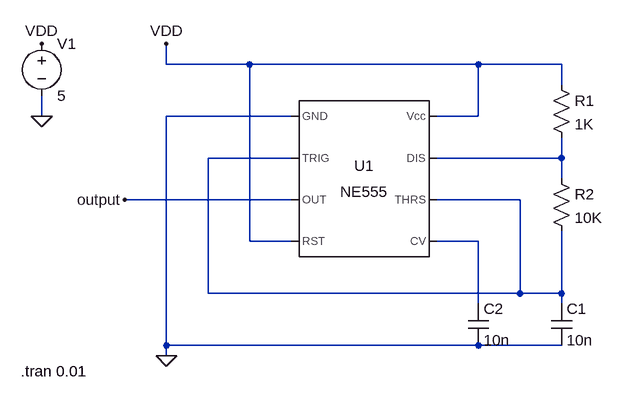
[diagram p0: schematic Design2_10k.asc]
Design2_10k.asc, the LTspice schematic file:
Version 4
SHEET 1 880 680
WIRE -128 -32 -128 -64
WIRE 0 -32 -128 -32
WIRE 352 -32 0 -32
WIRE 480 -32 352 -32
WIRE 480 0 480 -32
WIRE -320 48 -320 16
WIRE 64 48 -128 48
WIRE 352 48 352 -32
WIRE 352 48 288 48
WIRE 64 112 -64 112
WIRE 480 112 480 80
WIRE 480 112 288 112
WIRE 480 144 480 112
WIRE 64 176 -192 176
WIRE 416 176 288 176
WIRE 0 240 0 -32
WIRE 64 240 0 240
WIRE 352 240 288 240
WIRE -64 320 -64 112
WIRE 416 320 416 176
WIRE 416 320 -64 320
WIRE 480 320 480 224
WIRE 480 320 416 320
WIRE 352 336 352 240
WIRE 480 336 480 320
WIRE -128 400 -128 48
WIRE 352 400 -128 400
WIRE 480 400 352 400
WIRE -128 416 -128 400
FLAG -128 416 0
FLAG -128 -64 VDD
FLAG -192 176 output
FLAG -320 -64 VDD
FLAG -320 48 0
SYMBOL Misc\\NE555 176 144 R0
SYMATTR InstName U1
SYMBOL res 464 -16 R0
SYMATTR InstName R1
SYMATTR Value 1K
SYMBOL res 464 128 R0
SYMATTR InstName R2
SYMATTR Value 10K
SYMBOL cap 464 336 R0
SYMATTR InstName C1
SYMATTR Value 10n
SYMBOL cap 336 336 R0
SYMATTR InstName C2
SYMATTR Value 10n
SYMBOL voltage -320 -80 R0
WINDOW 123 0 0 Left 0
WINDOW 39 0 0 Left 0
SYMATTR InstName V1
SYMATTR Value 5
TEXT -352 440 Left 2 !.tran 0.01

The netlist it stands for:
* Design2_10k.asc
XU1 0 N001 output VDD N003 N001 N002 VDD NE555  ; pins GND TRIG OUT RST CV THRS DIS Vcc
R1 VDD N002 1K
R2 N002 N001 10K
C1 N001 0 10n
C2 N003 0 10n
V1 VDD 0 5
.tran 0.01
.lib NE555.sub
.backanno
.end